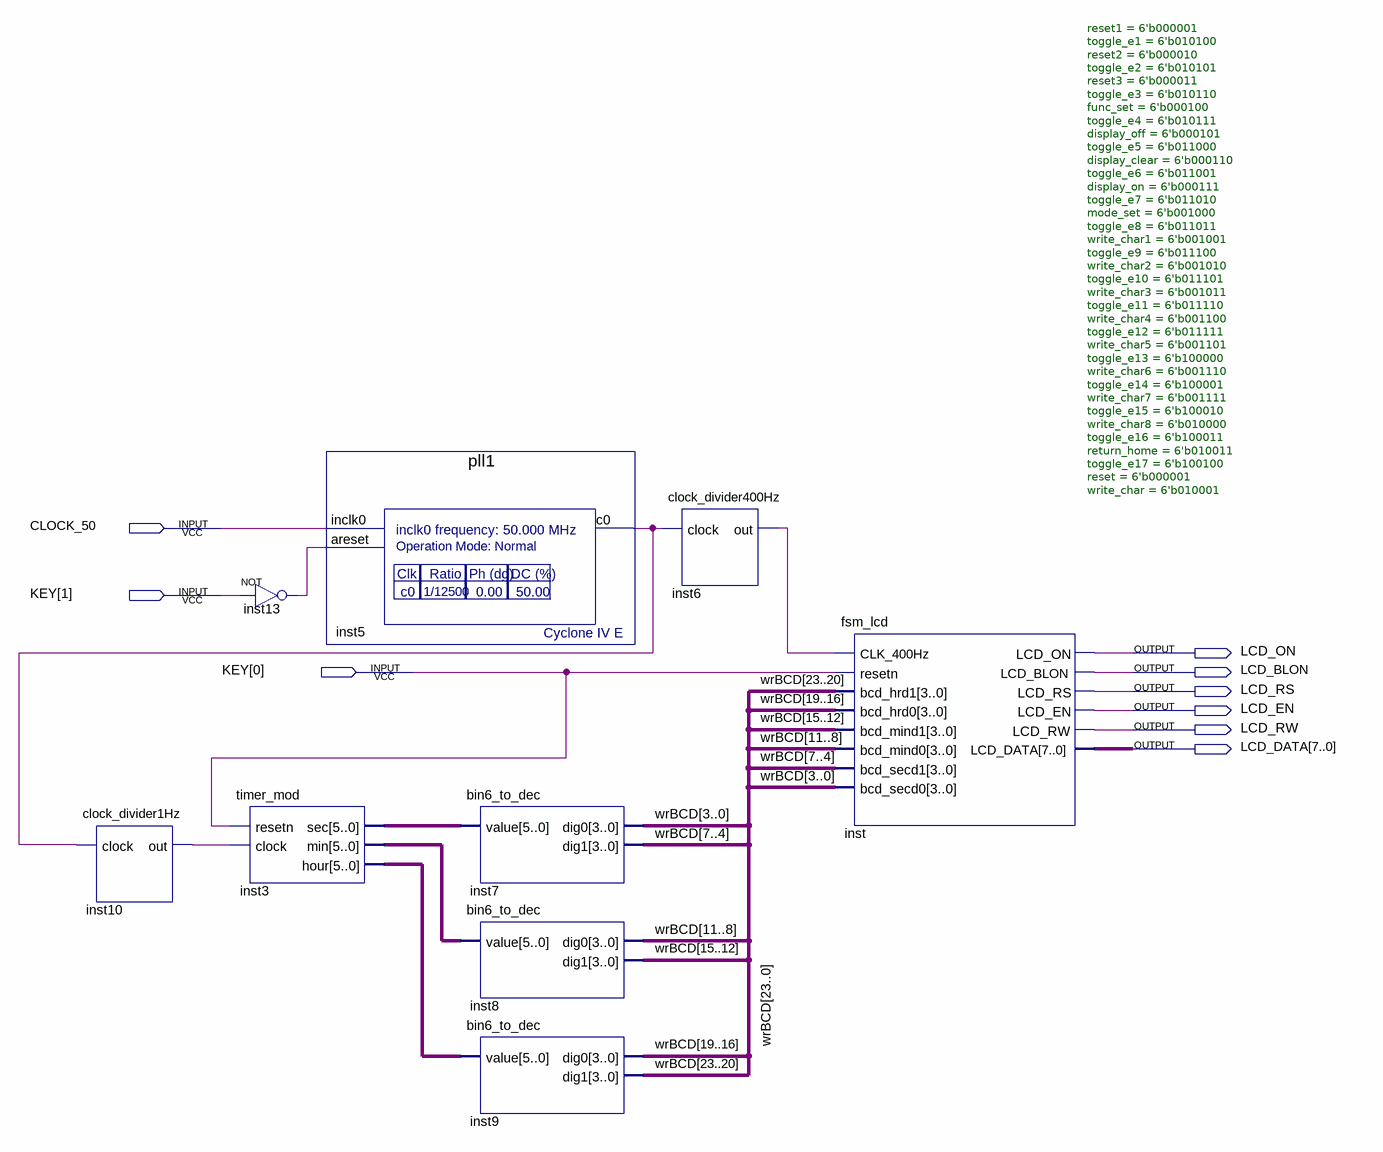
[diagram p0: schematic sheet]
// Quartus schematic lcd.bdf as structural Verilog: 9 symbols, 9 pins
module lcd (
  input  CLOCK_50,
  input  [1:0] KEY,
  output LCD_ON,
  output LCD_BLON,
  output LCD_RS,
  output LCD_EN,
  output LCD_RW,
  output [7:0] LCD_DATA
);

  wire inst5_c0, inst6_out, inst10_out, inst13_out;
  wire [5:0] inst3_hour, inst3_min, inst3_sec;
  wire [23:0] wrBCD;

  clock_divider1Hz inst10 (.clock(inst5_c0), .out(inst10_out));
  timer_mod inst3 (.resetn(KEY[0]), .clock(inst10_out), .sec(inst3_sec), .min(inst3_min), .hour(inst3_hour));
  not inst13 (inst13_out, KEY[1]);
  pll1 inst5 (.inclk0(CLOCK_50), .areset(inst13_out), .c0(inst5_c0));
  bin6_to_dec inst7 (.value(inst3_sec), .dig0(wrBCD[3:0]), .dig1(wrBCD[7:4]));
  bin6_to_dec inst8 (.value(inst3_min), .dig0(wrBCD[11:8]), .dig1(wrBCD[15:12]));
  bin6_to_dec inst9 (.value(inst3_hour), .dig0(wrBCD[19:16]), .dig1(wrBCD[23:20]));
  clock_divider400Hz inst6 (.clock(inst5_c0), .out(inst6_out));
  fsm_lcd #(.reset1(6'b000001), .toggle_e1(6'b010100), .reset2(6'b000010), .toggle_e2(6'b010101), .reset3(6'b000011), .toggle_e3(6'b010110), .func_set(6'b000100), .toggle_e4(6'b010111), .display_off(6'b000101), .toggle_e5(6'b011000), .display_clear(6'b000110), .toggle_e6(6'b011001), .display_on(6'b000111), .toggle_e7(6'b011010), .mode_set(6'b001000), .toggle_e8(6'b011011), .write_char1(6'b001001), .toggle_e9(6'b011100), .write_char2(6'b001010), .toggle_e10(6'b011101), .write_char3(6'b001011), .toggle_e11(6'b011110), .write_char4(6'b001100), .toggle_e12(6'b011111), .write_char5(6'b001101), .toggle_e13(6'b100000), .write_char6(6'b001110), .toggle_e14(6'b100001), .write_char7(6'b001111), .toggle_e15(6'b100010), .write_char8(6'b010000), .toggle_e16(6'b100011), .return_home(6'b010011), .toggle_e17(6'b100100), .reset(6'b000001), .write_char(6'b010001)) inst (
    .CLK_400Hz(inst6_out), .resetn(KEY[0]), .bcd_hrd1(wrBCD[23:20]), .bcd_hrd0(wrBCD[19:16]),
    .bcd_mind1(wrBCD[15:12]), .bcd_mind0(wrBCD[11:8]), .bcd_secd1(wrBCD[7:4]), .bcd_secd0(wrBCD[3:0]),
    .LCD_ON(LCD_ON), .LCD_BLON(LCD_BLON), .LCD_RS(LCD_RS), .LCD_EN(LCD_EN), .LCD_RW(LCD_RW),
    .LCD_DATA(LCD_DATA));
endmodule
